# EAGLE schematic inductive-conductivity-meter_coil_board (EAGLE 7.6.0)
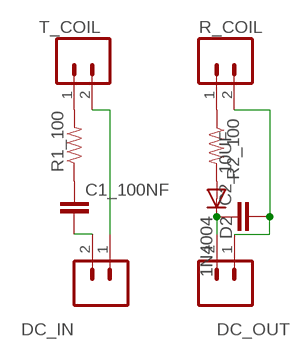
[diagram p0: schematic, sheet 1]

## Parts
C1_100NF  CAPPTH1  [CAP-PTH-5MM]
C2_10UF  CAPPTH1  [CAP-PTH-5MM]
D2  1N4004  [DO41-10]
DC_IN  M02PTH  [1X02]
DC_OUT  M02PTH  [1X02]
R1_100  RESISTOREZ  [AXIAL-0.3EZ]
R2_100  RESISTOREZ  [AXIAL-0.3EZ]
R_COIL  M02PTH  [1X02]
T_COIL  M02PTH  [1X02]

## Nets
GND_R: C2_10UF.2 DC_OUT.1 R_COIL.2
GND_T: DC_IN.1 T_COIL.2
N$1: C1_100NF.1 R1_100.P$1
N$2: D2.A R2_100.P$2
N$3: C2_10UF.1 D2.C DC_OUT.2
N$4: C1_100NF.2 DC_IN.2
N$5: R1_100.P$2 T_COIL.1
N$7: R2_100.P$1 R_COIL.1

## Library data of the parts
C1_100NF C2_10UF = SparkFun-Passives:CAP: Capacitor Standard 0603 ceramic capacitor, and 0.1" leaded capacitor.
D2 = adafruit:1N4004: DIODE General purpose 1N400x type rectifier (With bigger pads) http://www.ladyada.net/library/pcb/eaglelibrary.html
DC_IN DC_OUT R_COIL T_COIL = SparkFun-Connectors:M02: Standard 2-pin 0.1" header. Use with - straight break away headers ( PRT-00116) - right angle break away headers (PRT-00553) - swiss pins (PRT-00743) - machine pins (PRT-00117) - female headers (PRT-00115) Molex polarized connector foot print use with: PRT-08233 with associated crimp pins and housings. 2.54_SCREWTERM for use with PRT-10571. 3.5mm Screw Terminal footprints for PRT-08084 5mm Screw Terminal footprints for use with PRT-08432
R1_100 R2_100 = SparkFun-Passives:RESISTOR: Resistor Basic schematic elements and footprints for 0603, 1206, and PTH resistors.